# Altium schematic sheet 09-USB.SchDoc
size C
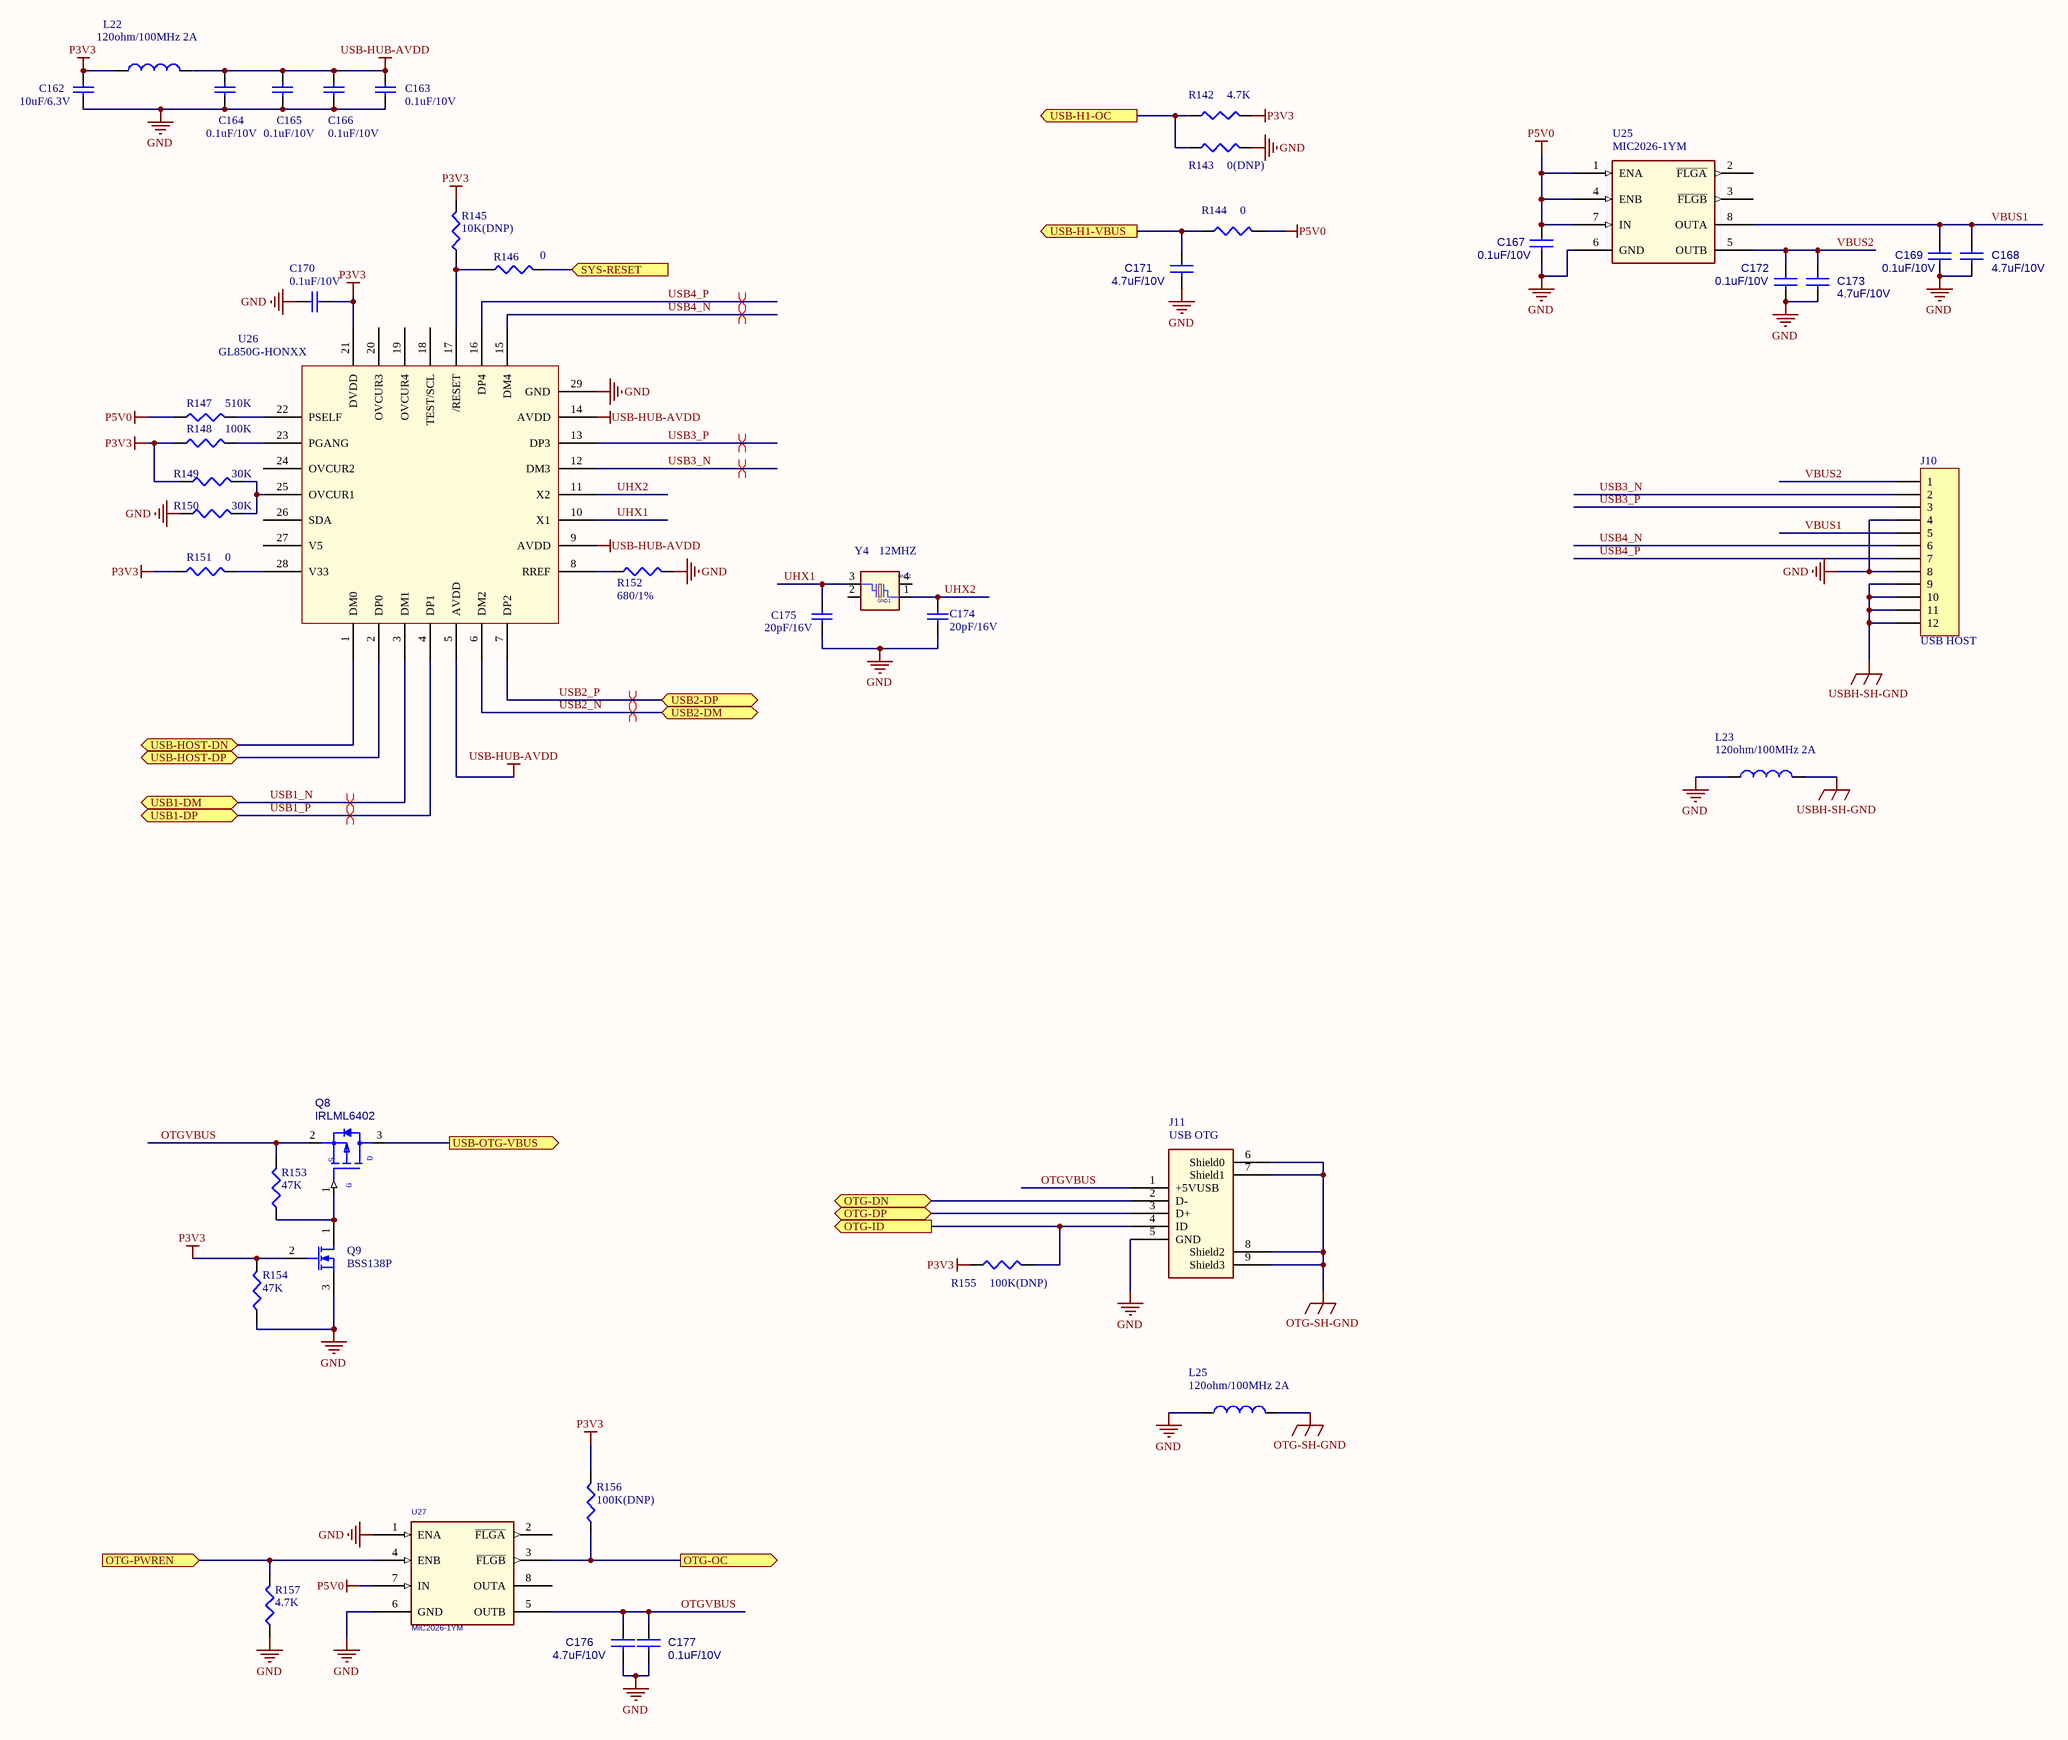
[diagram p0: 09-USB.SchDoc]

## Parts
C162  10uF/6.3V  [0805]
C163  0.1uF/10V  [0402]
C164  0.1uF/10V  [0402]
C165  0.1uF/10V  [0402]
C166  0.1uF/10V  [0402]
C167  0.1uF/10V  [0402]
C168  4.7uF/10V  [0805]
C169  0.1uF/10V  [0402]
C170  0.1uF/10V  [0402]
C171  4.7uF/10V  [0805]
C172  0.1uF/10V  [0402]
C173  4.7uF/10V  [0805]
C174  20pF/16V  [0402]
C175  20pF/16V  [0402]
C176  4.7uF/10V  [0805]
C177  0.1uF/10V  [0402]
J10  USB HOST  [USB-HOST-2]
J11  USB OTG  [MINIUSB-TYPEAB]
L22  120ohm/100MHz 2A  [0603]
L23  120ohm/100MHz 2A  [0603]
L25  120ohm/100MHz 2A  [0603]
Q8  IRLML6402  [MOSFET]
Q9  BSS138P  [NPN]
R142  4.7K  [0402]
R143  0(DNP)  [0402]
R144  0  [0603]
R145  10K(DNP)  [0402]
R146  0  [0402]
R147  510K  [0402]
R148  100K  [0402]
R149  30K  [0402]
R150  30K  [0402]
R151  0  [0402]
R152  680/1%  [0402]
R153  47K  [0402]
R154  47K  [0402]
R155  100K(DNP)  [0402]
R156  100K(DNP)  [0402]
R157  4.7K  [0402]
U25  MIC2026-1YM  [SO8]
U26  GL850G-HONXX
U27  MIC2026-1YM  [SO8]
Y4  12MHZ  [XTAL4_SX_3225]

## Ports
OTG-DN, OTG-DP (bidir), OTG-ID (out), OTG-OC (out), OTG-PWREN (in), SYS-RESET (in), USB1-DM, USB1-DP, USB2-DM, USB2-DP, USB-H1-OC (out), USB-H1-VBUS (out), USB-HOST-DN (bidir), USB-HOST-DP (bidir), USB-OTG-VBUS (out)

## Nets
GND: C162.1 C163.1 C164.1 C165.1 C166.1 C167.2 C168.2 C169.2 C170.2 C171.2 C172.2 C173.2 C174.1 C175.1 C176.2 C177.2 J10.4 J10.8 J11.5(GND) L23.1 L25.1 Q9.3(S) R143.2 R150.1 R152.2 R154.1 R157.1 U25.6(GND) U26.29(GND) U27.1(ENA) U27.6(GND)
OTG-SH-GND: J11.6(Shield0) J11.7(Shield1) J11.8(Shield2) J11.9(Shield3) L25.2
P3V3: C162.2 C170.1 L22.1 Q9.2(G) R142.2 R145.2 R148.1 R149.1 R151.1 R154.2 R155.1 R156.2 U26.21(DVDD)
P5V0: C167.1 R144.2 R147.1 U25.1(ENA) U25.4(ENB) U25.7(IN) U27.7(IN)
USB-HUB-AVDD: C163.2 C164.2 C165.2 C166.2 L22.2 U26.5(AVDD) U26.9(AVDD) U26.14(AVDD)
USBH-SH-GND: J10.9 J10.10 J10.11 J10.12 L23.2
OTG-DN: J11.2(D-) ; port OTG-DN
OTG-DP: J11.3(D+) ; port OTG-DP
OTG-ID: J11.4(ID) R155.2 ; port OTG-ID
OTG-OC: R156.1 U27.3(~{FLGB}) ; port OTG-OC
OTG-PWREN: R157.2 U27.4(ENB) ; port OTG-PWREN
OTGVBUS: C176.1 C177.1 J11.1(+5VUSB) Q8.2(S) R153.2 U27.5(OUTB)
SYS-RESET: R146.2 ; port SYS-RESET
UHX1: C175.2 U26.10(X1) Y4.3
UHX2: C174.2 U26.11(X2) Y4.1
USB1_N: U26.3(DM1) ; port USB1-DM
USB1_P: U26.4(DP1) ; port USB1-DP
USB2_N: U26.6(DM2) ; port USB2-DM
USB2_P: U26.7(DP2) ; port USB2-DP
USB3_N: J10.2 U26.12(DM3)
USB3_P: J10.3 U26.13(DP3)
USB4_N: J10.6 U26.15(DM4)
USB4_P: J10.7 U26.16(DP4)
USB-H1-OC: R142.1 R143.1 ; port USB-H1-OC
USB-H1-VBUS: C171.1 R144.1 ; port USB-H1-VBUS
USB-HOST-DN: U26.1(DM0) ; port USB-HOST-DN
USB-HOST-DP: U26.2(DP0) ; port USB-HOST-DP
USB-OTG-VBUS: Q8.3(D) ; port USB-OTG-VBUS
VBUS1: C168.1 C169.1 J10.5 U25.8(OUTA)
VBUS2: C172.1 C173.1 J10.1 U25.5(OUTB)
NetQ8_1: Q8.1(G) Q9.1(D) R153.1
NetR145_1: R145.1 R146.1 U26.17(/RESET)
NetR147_2: R147.2 U26.22(PSELF)
NetR148_2: R148.2 U26.23(PGANG)
NetR149_2: R149.2 R150.2 U26.25(OVCUR1)
NetR151_2: R151.2 U26.28(V33)
NetR152_1: R152.1 U26.8(RREF)

Not connected (* = marked no-connect by the designer): U25 2(~{FLGA}) 3(~{FLGB}); U26 18(TEST/SCL) 19(OVCUR4) 20(OVCUR3) 24(OVCUR2) 26(SDA) 27(V5); U27 2(~{FLGA}) 8(OUTA); Y4 2(GND1) 4(GND2)

## Layout directives
differential pair: USB1_N, USB1_P, USB2_N, USB2_P, USB3_N, USB3_P, USB4_N, USB4_P

## Library data of the parts
C162-C166 C170 C174 C175 = Cap: Capacitor; Published: 8-Jun-2000; LatestRevisionDate: 17-Jul-2002; LatestRevisionNote: Re-released for DXP Platform.; PackageReference: RAD-0.3; Publisher: Altium Limited; PackageDescription: Radial Cap, Thru-Hole; 2 Leads; 0.3 in Pin Spacing
C167-C169 C171-C173 C176 C177 = CAP_Dup1
J10 = Header 12: Header, 12-Pin; LatestRevisionDate: 17-Jul-2002; LatestRevisionNote: Re-released for DXP Platform.; Publisher: Altium Limited
J11 = FOX_UH51543-JS7: Part Number: SP063100800; NC: 10,11; ROOM: USB
L22 L23 L25 = Inductor: Code_IEC: 1005; Value: 300ohm/100MHz BEAD; Published: 8-Jun-2000; LatestRevisionDate: 29-May-2009; LatestRevisionNote: IPC-7351 Footprint Added.; PackageReference: 0402-A; Publisher: Altium Limited; PackageDescription: Chip Inductor; Code_JEITA: 0402
Q8 = AO3401L_SOT23-3_0: Part Number: SB934010010; ROOM: USB POWER; Part Value: AO3401L_SOT23-3
Q9 = MOSFET-N: N-Channel MOSFET; Published: 8-Jun-2000; LatestRevisionDate: 17-Jul-2002; LatestRevisionNote: Re-released for DXP Platform.; PackageVersion: 1995/1996; PackageReference: E3; Publisher: Altium Limited; PackageDescription: TO, Flat Index; 3 In-Line, Axial Leads; Body Dia. 4.6mm; Lead Dia. 0.5 mm (max)
R142-R157 = CR16-1003FM
U25 U27 = MIC2526_8P: IC LIN SW PWR ACTIVE HIGH DUAL 2.7V-5.5V 0.5A SOIC8; CAD_APPROVED: Yes; MFG_NAME01: MICREL; AGILE_PN: 312-75936; CLASS: IC; HEIGHT: 1.73mm; ROHS: Yes; MFG_PN01: MIC2026-1YM
Y4 = CRYSTAL_JXS63: XTAL 28.63636MHZ 10PF RSN -- SMT; CLASS: IC; PRIORITY_PN: 048-00268; CAD_APPROVED: Yes; MFG_PN01: ABM3B-28.63636MHZ-10-1-U-T; MFG_NAME01: ABRACON CORP; AGILE_PN: 230-76635; HEIGHT: 1.1MM; ROHS: Yes